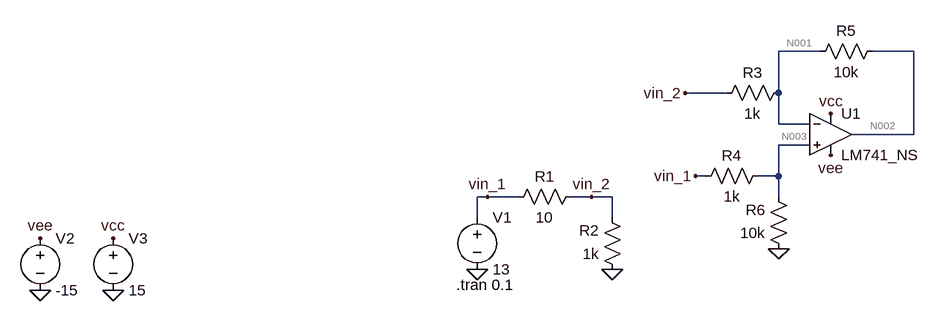
[diagram p0: schematic lab2.asc]
lab2.asc, the LTspice schematic file:
Version 4
SHEET 1 880 680
WIRE 64 -96 0 -96
WIRE 208 -96 144 -96
WIRE -80 -32 -144 -32
WIRE 0 -32 0 -96
WIRE 0 16 0 -32
WIRE 48 16 0 16
WIRE 208 32 208 -96
WIRE 208 32 112 32
WIRE 48 48 0 48
WIRE -112 96 -128 96
WIRE 0 96 0 48
WIRE 0 96 -32 96
WIRE -448 128 -464 128
WIRE -400 128 -448 128
WIRE -288 128 -320 128
WIRE -256 128 -288 128
WIRE 0 128 0 96
WIRE -464 160 -464 128
WIRE -256 160 -256 128
FLAG -448 128 vin_1
FLAG -288 128 vin_2
FLAG -256 240 0
FLAG -464 240 0
FLAG -128 96 vin_1
FLAG -144 -32 vin_2
FLAG 0 208 0
FLAG -1136 272 0
FLAG -1024 272 0
FLAG -1136 192 vee
FLAG 80 64 vee
FLAG -1024 192 vcc
FLAG 80 0 vcc
SYMBOL res -304 112 R90
WINDOW 0 0 56 VBottom 2
WINDOW 3 32 56 VTop 2
SYMATTR InstName R1
SYMATTR Value 10
SYMBOL res -240 256 R180
WINDOW 0 36 76 Left 2
WINDOW 3 36 40 Left 2
SYMATTR InstName R2
SYMATTR Value 1k
SYMBOL voltage -464 144 R0
WINDOW 123 0 0 Left 0
WINDOW 39 0 0 Left 0
SYMATTR InstName V1
SYMATTR Value 13
SYMBOL res 16 -48 R90
WINDOW 0 0 56 VBottom 2
WINDOW 3 32 56 VTop 2
SYMATTR InstName R3
SYMATTR Value 1k
SYMBOL res -16 80 R90
WINDOW 0 0 56 VBottom 2
WINDOW 3 32 56 VTop 2
SYMATTR InstName R4
SYMATTR Value 1k
SYMBOL res 160 -112 R90
WINDOW 0 0 56 VBottom 2
WINDOW 3 32 56 VTop 2
SYMATTR InstName R5
SYMATTR Value 10k
SYMBOL res 16 224 R180
WINDOW 0 36 76 Left 2
WINDOW 3 36 40 Left 2
SYMATTR InstName R6
SYMATTR Value 10k
SYMBOL AutoGenerated\\LM741_NS 80 -32 R0
SYMATTR InstName U1
SYMBOL voltage -1136 176 R0
WINDOW 123 0 0 Left 0
WINDOW 39 0 0 Left 0
SYMATTR InstName V2
SYMATTR Value -15
SYMBOL voltage -1024 176 R0
WINDOW 123 0 0 Left 0
WINDOW 39 0 0 Left 0
SYMATTR InstName V3
SYMATTR Value 15
TEXT -496 264 Left 2 !.tran 0.1

The netlist it stands for:
* lab2.asc
R1 vin_2 vin_1 10
R2 0 vin_2 1k
V1 vin_1 0 13
R3 N001 vin_2 1k
R4 N003 vin_1 1k
R5 N002 N001 10k
R6 0 N003 10k
* U1: LM741_NS (symbol AutoGenerated\LM741_NS not available, pins judged from their places): In+=N003 In-=N001 V+=vcc V-=vee OUT=N002
V2 vee 0 -15
V3 vcc 0 15
.tran 0.1
.backanno
.end

* Results of the author's LTspice run, read from the files saved beside the schematic
* Operating Point, zero values left out:
*   V(vin_2) = 12.86 V
*   V(vin_1) = 13 V
*   V(n001) = 11.82 V
*   V(n003) = 11.82 V
*   V(n002) = 1.406 V
*   V(vee) = -15 V
*   V(vcc) = 15 V
*   I(R6) = -1.182 mA
*   I(R5) = -1.041 mA
*   I(R4) = -1.182 mA
*   I(R3) = -1.041 mA
*   I(R2) = -12.86 mA
*   I(R1) = -13.9 mA
*   I(V3) = -1.627 mA
*   I(V2) = 2.669 mA
*   I(V1) = -15.08 mA
*   Ix(u1:1) = 57.15 nA
*   Ix(u1:2) = 102.6 nA
*   Ix(u1:99) = 1.627 mA
*   Ix(u1:50) = -2.669 mA
*   Ix(u1:28) = 1.041 mA